# Altium project SDC_2.PrjPcb
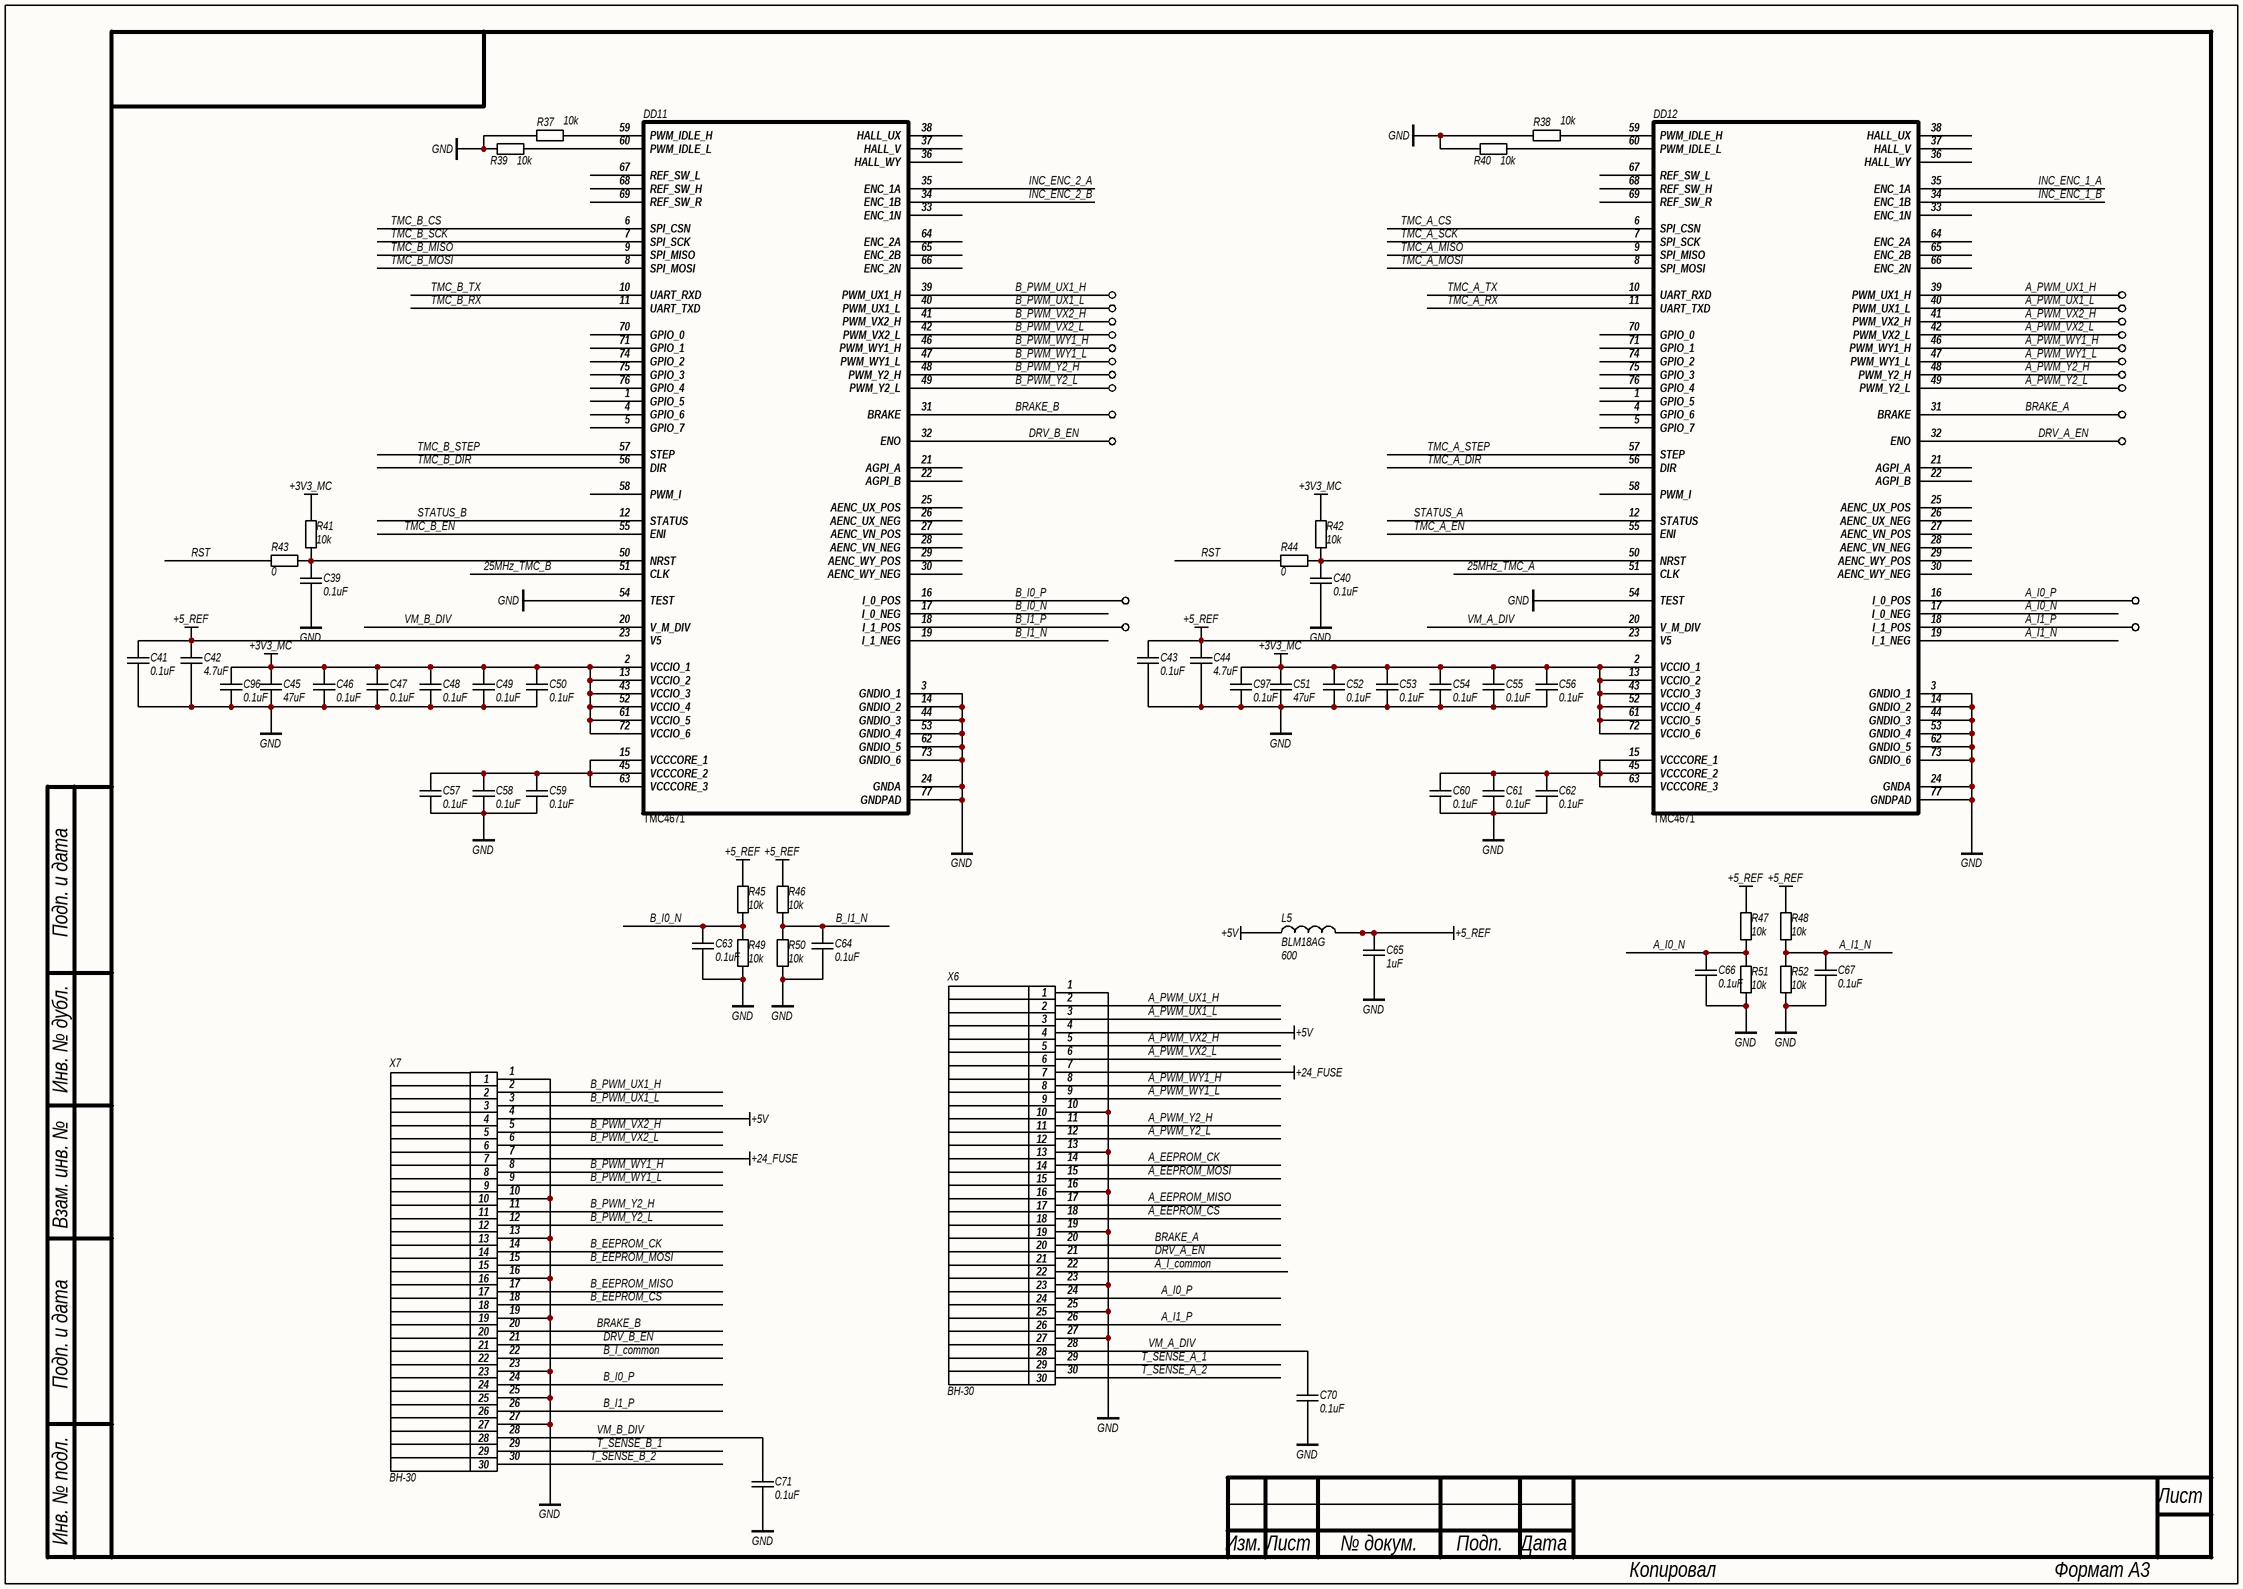
[diagram p0: SDC_3.SchDoc]
2 sheets, 160 parts. Net scope: global (net labels, ports and power ports of the same name join across sheets).
Board file: SDC.PcbDoc
Sheets:
  SDC_3.SchDoc
  SDC_4.SchDoc

## Sheet SDC_3.SchDoc
size 420 x 297 mm; PageSetup: Record=PageOptions|CenterHorizontal=False|CenterVertical=False|PrintScale=0.95|XCorrection=0.00|YCorrection=0.00|PrintKind=1|BorderSize=5000000|LeftOffset=0|BottomOffset=0|Orientation=1|PaperLength=1000|PaperWidth=1000|Scale=100|PaperSource=15|PrintQuality=600|MediaType=1|DitherType=10|PaperKind=A4|PrintScaleMode=1

### Parts
C39  value 0.1uF  [C0603]  (hidden comment: CAP)
C40  value 0.1uF  [C0603]  (hidden comment: CAP)
C41  value 0.1uF  [C0603]  (hidden comment: CAP)
C42  value 4.7uF  [C0603]  (hidden comment: CAP)
C43  value 0.1uF  [C0603]  (hidden comment: CAP)
C44  value 4.7uF  [C0603]  (hidden comment: CAP)
C45  value 47uF  [C1206]  (hidden comment: CAP)
C46  value 0.1uF  [C0603]  (hidden comment: CAP)
C47  value 0.1uF  [C0603]  (hidden comment: CAP)
C48  value 0.1uF  [C0603]  (hidden comment: CAP)
C49  value 0.1uF  [C0603]  (hidden comment: CAP)
C50  value 0.1uF  [C0603]  (hidden comment: CAP)
C51  value 47uF  [C1206]  (hidden comment: CAP)
C52  value 0.1uF  [C0603]  (hidden comment: CAP)
C53  value 0.1uF  [C0603]  (hidden comment: CAP)
C54  value 0.1uF  [C0603]  (hidden comment: CAP)
C55  value 0.1uF  [C0603]  (hidden comment: CAP)
C56  value 0.1uF  [C0603]  (hidden comment: CAP)
C57  value 0.1uF  [C0603]  (hidden comment: CAP)
C58  value 0.1uF  [C0603]  (hidden comment: CAP)
C59  value 0.1uF  [C0603]  (hidden comment: CAP)
C60  value 0.1uF  [C0603]  (hidden comment: CAP)
C61  value 0.1uF  [C0603]  (hidden comment: CAP)
C62  value 0.1uF  [C0603]  (hidden comment: CAP)
C63  value 0.1uF  [C0603]  (hidden comment: CAP)
C64  value 0.1uF  [C0603]  (hidden comment: CAP)
C65  value 1uF  [C0603]  (hidden comment: CAP)
C66  value 0.1uF  [C0603]  (hidden comment: CAP)
C67  value 0.1uF  [C0603]  (hidden comment: CAP)
C70  value 0.1uF  [C0603]  (hidden comment: CAP)
C71  value 0.1uF  [C0603]  (hidden comment: CAP)
C96  value 0.1uF  [C0603]  (hidden comment: CAP)
C97  value 0.1uF  [C0603]  (hidden comment: CAP)
DD11  TMC4671  [QFN76]
DD12  TMC4671  [QFN76]
L5  BLM18AG  value 600  [R0603]
R37  value 10k  [R0603]  (hidden comment: RES)
R38  value 10k  [R0603]  (hidden comment: RES)
R39  value 10k  [R0603]  (hidden comment: RES)
R40  value 10k  [R0603]  (hidden comment: RES)
R41  value 10k  [R0603]  (hidden comment: RES)
R42  value 10k  [R0603]  (hidden comment: RES)
R43  value 0  [R0603]  (hidden comment: RES)
R44  value 0  [R0603]  (hidden comment: RES)
R45  value 10k  [R0603]  (hidden comment: RES)
R46  value 10k  [R0603]  (hidden comment: RES)
R47  value 10k  [R0603]  (hidden comment: RES)
R48  value 10k  [R0603]  (hidden comment: RES)
R49  value 10k  [R0603]  (hidden comment: RES)
R50  value 10k  [R0603]  (hidden comment: RES)
R51  value 10k  [R0603]  (hidden comment: RES)
R52  value 10k  [R0603]  (hidden comment: RES)
TP1  Test_point  [TP1]  (value not drawn)
TP2  Test_point  [TP1]  (value not drawn)
TP3  Test_point  [TP1]  (value not drawn)
TP4  Test_point  [TP1]  (value not drawn)
TP5  Test_point  [TP1]  (value not drawn)
TP6  Test_point  [TP1]  (value not drawn)
TP7  Test_point  [TP1]  (value not drawn)
TP8  Test_point  [TP1]  (value not drawn)
TP9  Test_point  [TP1]  (value not drawn)
TP10  Test_point  [TP1]  (value not drawn)
TP11  Test_point  [TP1]  (value not drawn)
TP12  Test_point  [TP1]  (value not drawn)
TP13  Test_point  [TP1]  (value not drawn)
TP14  Test_point  [TP1]  (value not drawn)
TP15  Test_point  [TP1]  (value not drawn)
TP16  Test_point  [TP1]  (value not drawn)
TP17  Test_point  [TP1]  (value not drawn)
TP18  Test_point  [TP1]  (value not drawn)
TP19  Test_point  [TP1]  (value not drawn)
TP20  Test_point  [TP1]  (value not drawn)
TP21  Test_point  [TP1]  (value not drawn)
TP22  Test_point  [TP1]  (value not drawn)
TP23  Test_point  [TP1]  (value not drawn)
TP24  Test_point  [TP1]  (value not drawn)
X6  BH-30  [IDC-30(BH-30)]
X7  BH-30  [IDC-30(BH-30)]

### Nets
+3V3_MC: C45.2 C46.2 C47.2 C48.2 C49.2 C50.2 C51.2 C52.2 C53.2 C54.2 C55.2 C56.2 C96.2 C97.2 DD11.2(VCCIO_1) DD11.13(VCCIO_2) DD11.43(VCCIO_3) DD11.52(VCCIO_4) DD11.61(VCCIO_5) DD11.72(VCCIO_6) DD12.2(VCCIO_1) DD12.13(VCCIO_2) DD12.43(VCCIO_3) DD12.52(VCCIO_4) DD12.61(VCCIO_5) DD12.72(VCCIO_6) R41.2 R42.2
+5_REF: C41.2 C42.2 C43.2 C44.2 C65.2 DD11.23(V5) DD12.23(V5) L5.2 R45.2 R46.2 R47.2 R48.2
+5V: L5.1 X6.4 X7.4
+24_FUSE: X6.7 X7.7
GND: C39.1 C40.1 C41.1 C42.1 C43.1 C44.1 C45.1 C46.1 C47.1 C48.1 C49.1 C50.1 C51.1 C52.1 C53.1 C54.1 C55.1 C56.1 C57.1 C58.1 C59.1 C60.1 C61.1 C62.1 C63.1 C64.1 C65.1 C66.1 C67.1 C70.1 C71.1 C96.1 C97.1 DD11.3(GNDIO_1) DD11.14(GNDIO_2) DD11.24(GNDA) DD11.44(GNDIO_3) DD11.53(GNDIO_4) DD11.54(TEST) DD11.62(GNDIO_5) DD11.73(GNDIO_6) DD11.77(GNDPAD) DD12.3(GNDIO_1) DD12.14(GNDIO_2) DD12.24(GNDA) DD12.44(GNDIO_3) DD12.53(GNDIO_4) DD12.54(TEST) DD12.62(GNDIO_5) DD12.73(GNDIO_6) DD12.77(GNDPAD) R37.2 R38.2 R39.2 R40.2 R49.1 R50.1 R51.1 R52.1 X6.1 X6.10 X6.13 X6.16 X6.19 X6.23 X6.25 X6.27 X7.1 X7.10 X7.13 X7.16 X7.19 X7.23 X7.25 X7.27
25MHz_TMC_A: DD12.51(CLK)
25MHz_TMC_B: DD11.51(CLK)
A_EEPROM_CK: X6.14
A_EEPROM_CS: X6.18
A_EEPROM_MISO: X6.17
A_EEPROM_MOSI: X6.15
A_I0_N: C66.2 DD12.17(I_0_NEG) R47.1 R51.2
A_I0_P: DD12.16(I_0_POS) TP23.1 X6.24
A_I1_N: C67.2 DD12.19(I_1_NEG) R48.1 R52.2
A_I1_P: DD12.18(I_1_POS) TP24.1 X6.26
A_I_common: X6.22
A_PWM_UX1_H: DD12.39(PWM_UX1_H) TP2.1 X6.2
A_PWM_UX1_L: DD12.40(PWM_UX1_L) TP4.1 X6.3
A_PWM_VX2_H: DD12.41(PWM_VX2_H) TP6.1 X6.5
A_PWM_VX2_L: DD12.42(PWM_VX2_L) TP8.1 X6.6
A_PWM_WY1_H: DD12.46(PWM_WY1_H) TP10.1 X6.8
A_PWM_WY1_L: DD12.47(PWM_WY1_L) TP12.1 X6.9
A_PWM_Y2_H: DD12.48(PWM_Y2_H) TP14.1 X6.11
A_PWM_Y2_L: DD12.49(PWM_Y2_L) TP16.1 X6.12
B_EEPROM_CK: X7.14
B_EEPROM_CS: X7.18
B_EEPROM_MISO: X7.17
B_EEPROM_MOSI: X7.15
B_I0_N: C63.2 DD11.17(I_0_NEG) R45.1 R49.2
B_I0_P: DD11.16(I_0_POS) TP19.1 X7.24
B_I1_N: C64.2 DD11.19(I_1_NEG) R46.1 R50.2
B_I1_P: DD11.18(I_1_POS) TP20.1 X7.26
B_I_common: X7.22
B_PWM_UX1_H: DD11.39(PWM_UX1_H) TP1.1 X7.2
B_PWM_UX1_L: DD11.40(PWM_UX1_L) TP3.1 X7.3
B_PWM_VX2_H: DD11.41(PWM_VX2_H) TP5.1 X7.5
B_PWM_VX2_L: DD11.42(PWM_VX2_L) TP7.1 X7.6
B_PWM_WY1_H: DD11.46(PWM_WY1_H) TP9.1 X7.8
B_PWM_WY1_L: DD11.47(PWM_WY1_L) TP11.1 X7.9
B_PWM_Y2_H: DD11.48(PWM_Y2_H) TP13.1 X7.11
B_PWM_Y2_L: DD11.49(PWM_Y2_L) TP15.1 X7.12
BRAKE_A: DD12.31(BRAKE) TP22.1 X6.20
BRAKE_B: DD11.31(BRAKE) TP21.1 X7.20
DRV_A_EN: DD12.32(ENO) TP18.1 X6.21
DRV_B_EN: DD11.32(ENO) TP17.1 X7.21
INC_ENC_1_A: DD12.35(ENC_1A)
INC_ENC_1_B: DD12.34(ENC_1B)
INC_ENC_2_A: DD11.35(ENC_1A)
INC_ENC_2_B: DD11.34(ENC_1B)
RST: R43.2 R44.2
STATUS_A: DD12.12(STATUS)
STATUS_B: DD11.12(STATUS)
T_SENSE_A_1: X6.29
T_SENSE_A_2: X6.30
T_SENSE_B_1: X7.29
T_SENSE_B_2: X7.30
TMC_A_CS: DD12.6(SPI_CSN)
TMC_A_DIR: DD12.56(DIR)
TMC_A_EN: DD12.55(ENI)
TMC_A_MISO: DD12.9(SPI_MISO)
TMC_A_MOSI: DD12.8(SPI_MOSI)
TMC_A_RX: DD12.11(UART_TXD)
TMC_A_SCK: DD12.7(SPI_SCK)
TMC_A_STEP: DD12.57(STEP)
TMC_A_TX: DD12.10(UART_RXD)
TMC_B_CS: DD11.6(SPI_CSN)
TMC_B_DIR: DD11.56(DIR)
TMC_B_EN: DD11.55(ENI)
TMC_B_MISO: DD11.9(SPI_MISO)
TMC_B_MOSI: DD11.8(SPI_MOSI)
TMC_B_RX: DD11.11(UART_TXD)
TMC_B_SCK: DD11.7(SPI_SCK)
TMC_B_STEP: DD11.57(STEP)
TMC_B_TX: DD11.10(UART_RXD)
VM_A_DIV: C70.2 DD12.20(V_M_DIV) X6.28
VM_B_DIV: C71.2 DD11.20(V_M_DIV) X7.28
NetC39_2: C39.2 DD11.50(NRST) R41.1 R43.1
NetC40_2: C40.2 DD12.50(NRST) R42.1 R44.1
NetC57_2: C57.2 C58.2 C59.2 DD11.15(VCCCORE_1) DD11.45(VCCCORE_2) DD11.63(VCCCORE_3)
NetC60_2: C60.2 C61.2 C62.2 DD12.15(VCCCORE_1) DD12.45(VCCCORE_2) DD12.63(VCCCORE_3)
NetDD11_59: DD11.59(PWM_IDLE_H) R37.1
NetDD11_60: DD11.60(PWM_IDLE_L) R39.1
NetDD12_59: DD12.59(PWM_IDLE_H) R38.1
NetDD12_60: DD12.60(PWM_IDLE_L) R40.1

Not connected (* = marked no-connect by the designer): DD11 1(GPIO_5) 4(GPIO_6) 5(GPIO_7) 21(AGPI_A) 22(AGPI_B) 25(AENC_UX_POS) 26(AENC_UX_NEG) 27(AENC_VN_POS) 28(AENC_VN_NEG) 29(AENC_WY_POS) 30(AENC_WY_NEG) 33(ENC_1N) 36(HALL_WY) 37(HALL_V) 38(HALL_UX) 58(PWM_I) 64(ENC_2A) 65(ENC_2B) 66(ENC_2N) 67(REF_SW_L) 68(REF_SW_H) 69(REF_SW_R) 70(GPIO_0) 71(GPIO_1) 74(GPIO_2) 75(GPIO_3) 76(GPIO_4); DD12 1(GPIO_5) 4(GPIO_6) 5(GPIO_7) 21(AGPI_A) 22(AGPI_B) 25(AENC_UX_POS) 26(AENC_UX_NEG) 27(AENC_VN_POS) 28(AENC_VN_NEG) 29(AENC_WY_POS) 30(AENC_WY_NEG) 33(ENC_1N) 36(HALL_WY) 37(HALL_V) 38(HALL_UX) 58(PWM_I) 64(ENC_2A) 65(ENC_2B) 66(ENC_2N) 67(REF_SW_L) 68(REF_SW_H) 69(REF_SW_R) 70(GPIO_0) 71(GPIO_1) 74(GPIO_2) 75(GPIO_3) 76(GPIO_4)

### Notes on the sheet
- Подп. и дата
- Инв. № дубл.
- Взам. инв. №
- Инв. № подл.
- Лист
- Изм.
- № докум.
- Подп.
- Дата
- Копировал
- Формат А3

### Library data of the parts
C39-C44 C46-C50 C52-C67 C70 C71 C96 C97 = CAP: SMD Capacitor; Manufacturer: Murata; Material: X7R; Tolerance: 10%; Voltage: 50V; Type: Ceramic Capacitor
C45 C51 = CAP: SMD Capacitor; Manufacturer: Murata; Material: X7R; Tolerance: 10%; Voltage: 10V; Type: Ceramic Capacitor
DD11 DD12 = TMC4671: Motion_controller
R37-R52 = RES: SMD Resistor; Name: Chip SMD Resistor; Power: 0.062 Wt; Tolerance: 5%; Temperature Range: -55…155°C
TP1-TP24 = TP
X6 X7 = IDC15x2_GOST

## Sheet SDC_4.SchDoc
size 420 x 297 mm; PageSetup: Record=PageOptions|CenterHorizontal=False|CenterVertical=False|PrintScale=0.95|XCorrection=0.00|YCorrection=0.00|PrintKind=1|BorderSize=5000000|LeftOffset=0|BottomOffset=0|Orientation=1|PaperLength=1000|PaperWidth=1000|Scale=100|PaperSource=15|PrintQuality=600|MediaType=1|DitherType=10|PaperKind=A4|PrintScaleMode=1
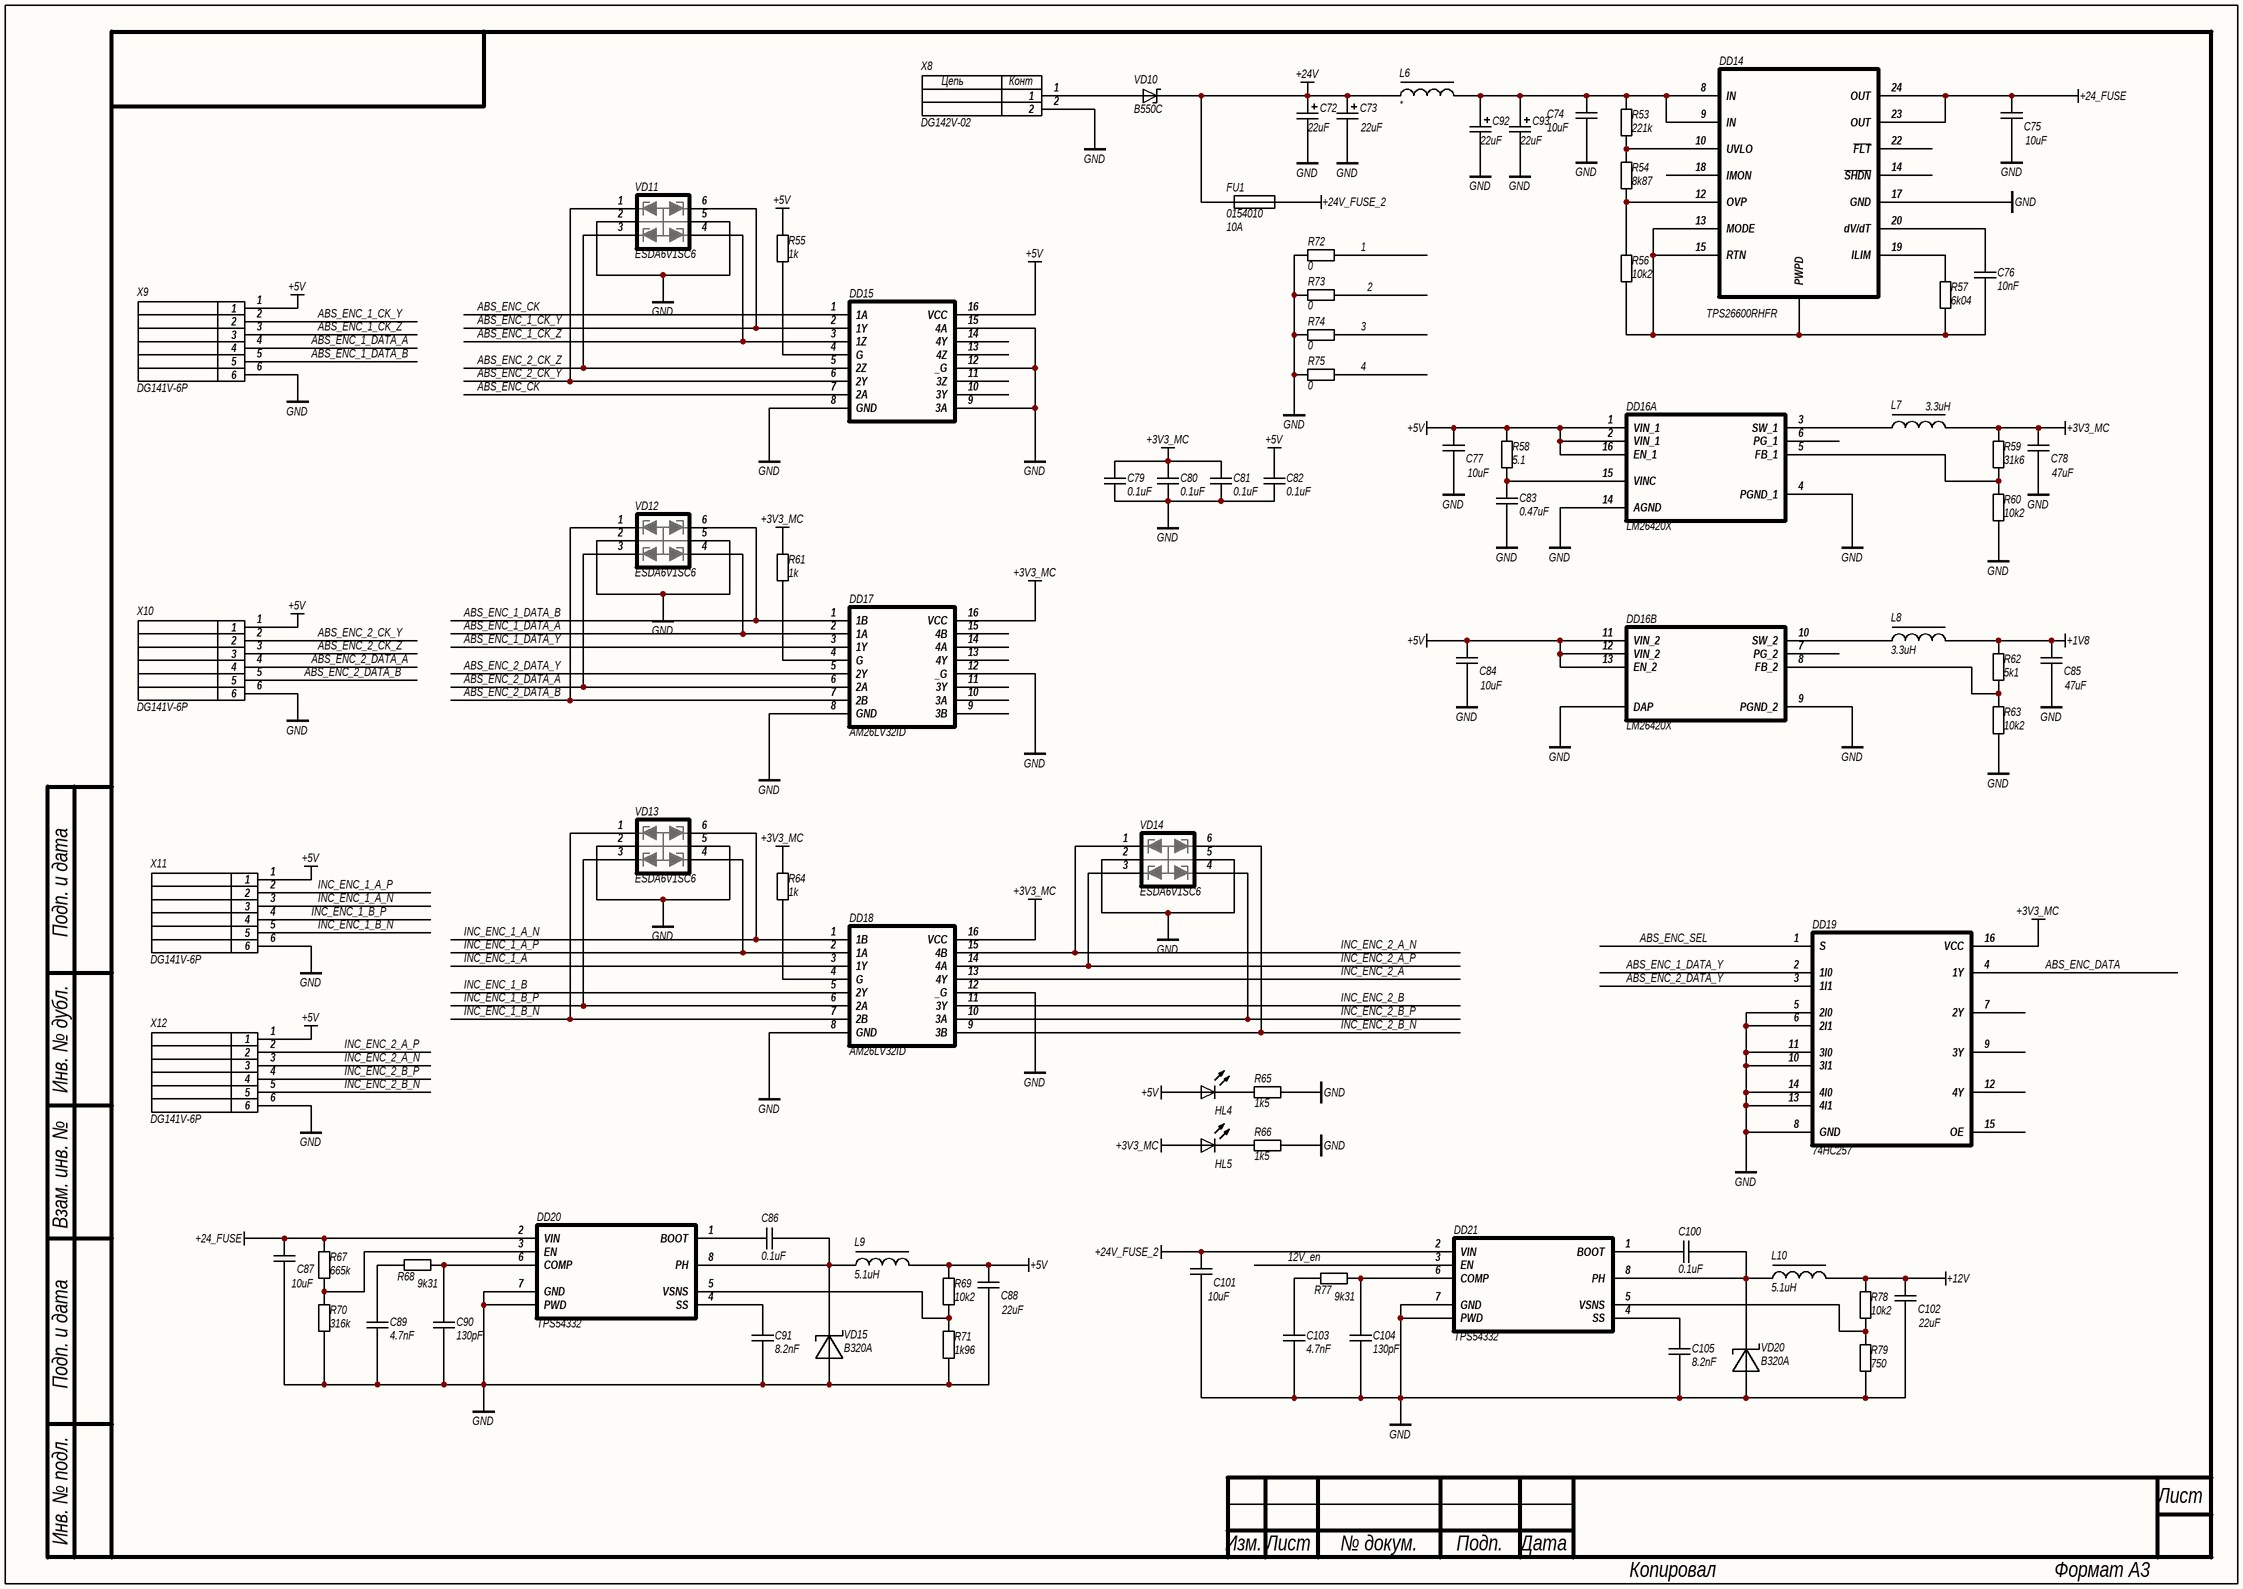
[diagram p1: SDC_4.SchDoc]

### Parts
C72  value 22uF  [Cap_D]  (hidden comment: caseD)
C73  value 22uF  [Cap_D]  (hidden comment: caseD)
C74  value 10uF  [C1210]  (hidden comment: CAP)
C75  value 10uF  [C1210]  (hidden comment: CAP)
C76  value 10nF  [C0603]  (hidden comment: CAP)
C77  value 10uF  [C1210]  (hidden comment: CAP)
C78  value 47uF  [C1210]  (hidden comment: CAP)
C79  value 0.1uF  [C0603]  (hidden comment: CAP)
C80  value 0.1uF  [C0603]  (hidden comment: CAP)
C81  value 0.1uF  [C0603]  (hidden comment: CAP)
C82  value 0.1uF  [C0603]  (hidden comment: CAP)
C83  value 0.47uF  [C0603]  (hidden comment: CAP)
C84  value 10uF  [C1210]  (hidden comment: CAP)
C85  value 47uF  [C1210]  (hidden comment: CAP)
C86  value 0.1uF  [C0603]  (hidden comment: CAP)
C87  value 10uF  [C0805]  (hidden comment: CAP)
C88  value 22uF  [C1210]  (hidden comment: CAP)
C89  value 4.7nF  [C0603]  (hidden comment: CAP)
C90  value 130pF  [C0603]  (hidden comment: CAP)
C91  value 8.2nF  [C0603]  (hidden comment: CAP)
C92  value 22uF  [Cap_D]  (hidden comment: caseD)
C93  value 22uF  [Cap_D]  (hidden comment: caseD)
C100  value 0.1uF  [C0603]  (hidden comment: CAP)
C101  value 10uF  [C0805]  (hidden comment: CAP)
C102  value 22uF  [C1210]  (hidden comment: CAP)
C103  value 4.7nF  [C0603]  (hidden comment: CAP)
C104  value 130pF  [C0603]  (hidden comment: CAP)
C105  value 8.2nF  [C0603]  (hidden comment: CAP)
DD14  TPS26600RHFR  [VQFN24]
DD15  AM26C31CD  [SO-16_N]  (value not drawn)
DD16  LM26420X  [WQFN16]  (parts A,B of 2)
DD17  AM26LV32ID  [SO-16_N]
DD18  AM26LV32ID  [SO-16_N]
DD19  74HC257  [SO-16_N]
DD20  TPS54332  [DDA]
DD21  TPS54332  [DDA]
FU1  0154010  current: 10A  [omni_block_154]
HL4  LED0603  [LED0603]  (value not drawn)
HL5  LED0603  [LED0603]  (value not drawn)
L6  XAL6060  [XAL6060]  (value not drawn)
L7  value 3.3uH  [XAL4030]  (hidden comment: XAL4030)
L8  value 3.3uH  [XAL4030]  (hidden comment: XAL4030)
L9  value 5.1uH  [XAL5050]  (hidden comment: XAL5050)
L10  value 5.1uH  [XAL5050]  (hidden comment: XAL5050)
R53  value 221k  [R0603]  (hidden comment: RES)
R54  value 8k87  [R0603]  (hidden comment: RES)
R55  value 1k  [R0603]  (hidden comment: RES)
R56  value 10k2  [R0603]  (hidden comment: RES)
R57  value 6k04  [R0603]  (hidden comment: RES)
R58  value 5.1  [R0603]  (hidden comment: RES)
R59  value 31k6  [R0603]  (hidden comment: RES)
R60  value 10k2  [R0603]  (hidden comment: RES)
R61  value 1k  [R0603]  (hidden comment: RES)
R62  value 5k1  [R0603]  (hidden comment: RES)
R63  value 10k2  [R0603]  (hidden comment: RES)
R64  value 1k  [R0603]  (hidden comment: RES)
R65  value 1k5  [R0603]  (hidden comment: RES)
R66  value 1k5  [R0603]  (hidden comment: RES)
R67  value 665k  [R0603]  (hidden comment: RES)
R68  value 9k31  [R0603]  (hidden comment: RES)
R69  value 10k2  [R0603]  (hidden comment: RES)
R70  value 316k  [R0603]  (hidden comment: RES)
R71  value 1k96  [R0603]  (hidden comment: RES)
R72  value 0  [R0603]  (hidden comment: RES)
R73  value 0  [R0603]  (hidden comment: RES)
R74  value 0  [R0603]  (hidden comment: RES)
R75  value 0  [R0603]  (hidden comment: RES)
R77  value 9k31  [R0603]  (hidden comment: RES)
R78  value 10k2  [R0603]  (hidden comment: RES)
R79  value 750  [R0603]  (hidden comment: RES)
VD10  B550C  [SMC-DO214]
VD11  ESDA6V1SC6  [SOT23-6]
VD12  ESDA6V1SC6  [SOT23-6]
VD13  ESDA6V1SC6  [SOT23-6]
VD14  ESDA6V1SC6  [SOT23-6]
VD15  B320A  [SMA-DO214]
VD20  B320A  [SMA-DO214]
X8  DG142V-02  [DG142V-02]
X9  DG141V-6P  [DG141V-06P]
X10  DG141V-6P  [DG141V-06P]
X11  DG141V-6P  [DG141V-06P]
X12  DG141V-6P  [DG141V-06P]

### Nets
+1V8: C85.2 L8.2 R62.2
+3V3_MC: C78.2 C79.2 C80.2 C81.2 DD17.16(VCC) DD18.16(VCC) DD19.16(VCC) HL5.1(A) L7.2 R59.2 R61.2 R64.2
+5V: C77.2 C82.2 C84.2 C88.2 DD15.16(VCC) DD16.1(VIN_1) DD16.2(VIN_1) DD16.11(VIN_2) DD16.12(VIN_2) DD16.13(EN_2) DD16.16(EN_1) HL4.1(A) L9.2 R55.2 R58.2 R69.2 X9.1 X10.1 X11.1 X12.1
+12V: C102.2 L10.2 R78.2
+24_FUSE: C75.2 C87.2 DD14.23(OUT) DD14.24(OUT) DD20.2(VIN) R67.2
+24V: C72.1 C73.1 FU1.1 L6.1 VD10.2(K)
+24V_FUSE_2: C101.2 DD21.2(VIN) FU1.2
GND: C72.2 C73.2 C74.1 C75.1 C77.1 C78.1 C79.1 C80.1 C81.1 C82.1 C83.1 C84.1 C85.1 C87.1 C88.1 C89.1 C90.1 C91.1 C92.2 C93.2 C101.1 C102.1 C103.1 C104.1 C105.1 DD14.17(GND) DD15.8(GND) DD15.9(3A) DD15.12(_G) DD15.15(4A) DD16.4(PGND_1) DD16.9(PGND_2) DD16.14(AGND) DD16.17(DAP) DD17.8(GND) DD17.12(_G) DD18.8(GND) DD18.12(_G) DD19.5(2I0) DD19.6(2I1) DD19.8(GND) DD19.10(3I1) DD19.11(3I0) DD19.13(4I1) DD19.14(4I0) DD20.7(GND) DD20.9(PWD) DD21.7(GND) DD21.9(PWD) R60.1 R63.1 R65.1 R66.1 R70.1 R71.1 R72.2 R73.2 R74.2 R75.2 R79.1 VD11.2 VD11.5 VD12.2 VD12.5 VD13.2 VD13.5 VD14.2 VD14.5 VD15.1(A) VD20.1(A) X8.2 X9.6 X10.6 X11.6 X12.6
1: R72.1
2: R73.1
3: R74.1
4: R75.1
12V_en: DD21.3(EN)
ABS_ENC_1_CK_Y: DD15.2(1Y) VD11.6 X9.2
ABS_ENC_1_CK_Z: DD15.3(1Z) VD11.4 X9.3
ABS_ENC_1_DATA_A: DD17.2(1A) VD12.4 X9.4
ABS_ENC_1_DATA_B: DD17.1(1B) VD12.6 X9.5
ABS_ENC_1_DATA_Y: DD17.3(1Y) DD19.2(1I0)
ABS_ENC_2_CK_Y: DD15.6(2Y) VD11.1 X10.2
ABS_ENC_2_CK_Z: DD15.5(2Z) VD11.3 X10.3
ABS_ENC_2_DATA_A: DD17.6(2A) VD12.3 X10.4
ABS_ENC_2_DATA_B: DD17.7(2B) VD12.1 X10.5
ABS_ENC_2_DATA_Y: DD17.5(2Y) DD19.3(1I1)
ABS_ENC_CK: DD15.1(1A) DD15.7(2A)
ABS_ENC_DATA: DD19.4(1Y)
ABS_ENC_SEL: DD19.1(S)
INC_ENC_1_A: DD18.3(1Y)
INC_ENC_1_A_N: DD18.1(1B) VD13.6 X11.3
INC_ENC_1_A_P: DD18.2(1A) VD13.4 X11.2
INC_ENC_1_B: DD18.5(2Y)
INC_ENC_1_B_N: DD18.7(2B) VD13.1 X11.5
INC_ENC_1_B_P: DD18.6(2A) VD13.3 X11.4
INC_ENC_2_A: DD18.13(4Y)
INC_ENC_2_A_N: DD18.15(4B) VD14.1 X12.3
INC_ENC_2_A_P: DD18.14(4A) VD14.3 X12.2
INC_ENC_2_B: DD18.11(3Y)
INC_ENC_2_B_N: DD18.9(3B) VD14.6 X12.5
INC_ENC_2_B_P: DD18.10(3A) VD14.4 X12.4
NetC74_2: C74.2 C92.1 C93.1 DD14.8(IN) DD14.9(IN) L6.2 R53.2
NetC76_1: C76.1 DD14.13(MODE) DD14.15(RTN) DD14.25(PWPD) R56.1 R57.1
NetC76_2: C76.2 DD14.20(dV/dT)
NetC83_2: C83.2 DD16.15(VINC) R58.1
NetC86_1: C86.1 DD20.8(PH) L9.1 VD15.2(K)
NetC86_2: C86.2 DD20.1(BOOT)
NetC89_2: C89.2 R68.2
NetC90_2: C90.2 DD20.6(COMP) R68.1
NetC91_2: C91.2 DD20.4(SS)
NetC100_1: C100.1 DD21.8(PH) L10.1 VD20.2(K)
NetC100_2: C100.2 DD21.1(BOOT)
NetC103_2: C103.2 R77.2
NetC104_2: C104.2 DD21.6(COMP) R77.1
NetC105_2: C105.2 DD21.4(SS)
NetDD14_10: DD14.10(UVLO) R53.1 R54.2
NetDD14_12: DD14.12(OVP) R54.1 R56.2
NetDD14_19: DD14.19(ILIM) R57.2
NetDD15_4: DD15.4(G) R55.1
NetDD16_3: DD16.3(SW_1) L7.1
NetDD16_5: DD16.5(FB_1) R59.1 R60.2
NetDD16_8: DD16.8(FB_2) R62.1 R63.2
NetDD16_10: DD16.10(SW_2) L8.1
NetDD17_4: DD17.4(G) R61.1
NetDD18_4: DD18.4(G) R64.1
NetDD20_3: DD20.3(EN) R67.1 R70.2
NetDD20_5: DD20.5(VSNS) R69.1 R71.2
NetDD21_5: DD21.5(VSNS) R78.1 R79.2
NetHL4_2: HL4.2(K) R65.2
NetHL5_2: HL5.2(K) R66.2
NetVD10_1: VD10.1(A) X8.1

Not connected (* = marked no-connect by the designer): DD14 14(~{SHDN}) 18(IMON) 22(~{FLT}); DD15 10(3Y) 11(3Z) 13(4Z) 14(4Y); DD16 6(PG_1) 7(PG_2); DD17 9(3B) 10(3A) 11(3Y) 13(4Y) 14(4A) 15(4B); DD19 7(2Y) 9(3Y) 12(4Y) 15(OE)

### Notes on the sheet
- Подп. и дата
- Инв. № дубл.
- Взам. инв. №
- Инв. № подл.
- Лист
- Изм.
- № докум.
- Подп.
- Дата
- Копировал
- Формат А3
- (in symbol DG142V-02) Цепь; Конт

### Library data of the parts
C72 C73 C92 C93 = Cap Pol_D: Polarized Capacitor (Surface Mount); voltage: 35V
C74-C76 C79-C83 C86 C87 C89-C91 C100 C101 C103-C105 = CAP: as C39 on sheet SDC_3
C77 C78 C84 C85 = CAP: as C45 on sheet SDC_3
C88 C102 = CAP: SMD Capacitor; Manufacturer: Murata; Material: X7R; Tolerance: 10%; Voltage: 25V; Type: Ceramic Capacitor
DD14 = TPS26600RHFR: Industrial eFuse; Current: 2A; Voltage: 60V; Name: TPS26600; Package: 16-Pin SOIC PowerPAD; Temperature Range: −40°C to + 125°C; Type: Industrial eFuse
DD15 = AM26C31CD: RS-422 transmitter
DD17 DD18 = AM26LV32ID: RS-422 receiver
DD19 = 74HC257: MUX
FU1 = 0154010: omni fuse block
L6 = XAL6060: chip inductor; value: *
L7 L8 = XAL4030: chip inductor
L9 L10 = XAL5050: chip inductor
R53-R75 R77-R79 = RES: as R37 on sheet SDC_3; Temperature Range: -55…155°C
VD10 = B550C: DIODE, SCHOTTKY, 5A, 50V, SMC
VD11-VD14 = ESDA6V1SC6: 4-line ESD protection
VD15 VD20 = B320A: Shottky diode
X9-X12 = DG141V-6P: wire connector

## Nets that join several sheets
+3V3_MC: SDC_3 (28 pins), SDC_4 (12 pins)
+5V: SDC_3 (L5.1 X6.4 X7.4), SDC_4 (20 pins)
+24_FUSE: SDC_3 (X6.7 X7.7), SDC_4 (6 pins)
GND: SDC_3 (75 pins), SDC_4 (75 pins)
INC_ENC_1_A: SDC_3 (DD12.35), SDC_4 (DD18.3)
INC_ENC_1_B: SDC_3 (DD12.34), SDC_4 (DD18.5)
INC_ENC_2_A: SDC_3 (DD11.35), SDC_4 (DD18.13)
INC_ENC_2_B: SDC_3 (DD11.34), SDC_4 (DD18.11)